# Altium project pinger-re-netlist.PrjPcb
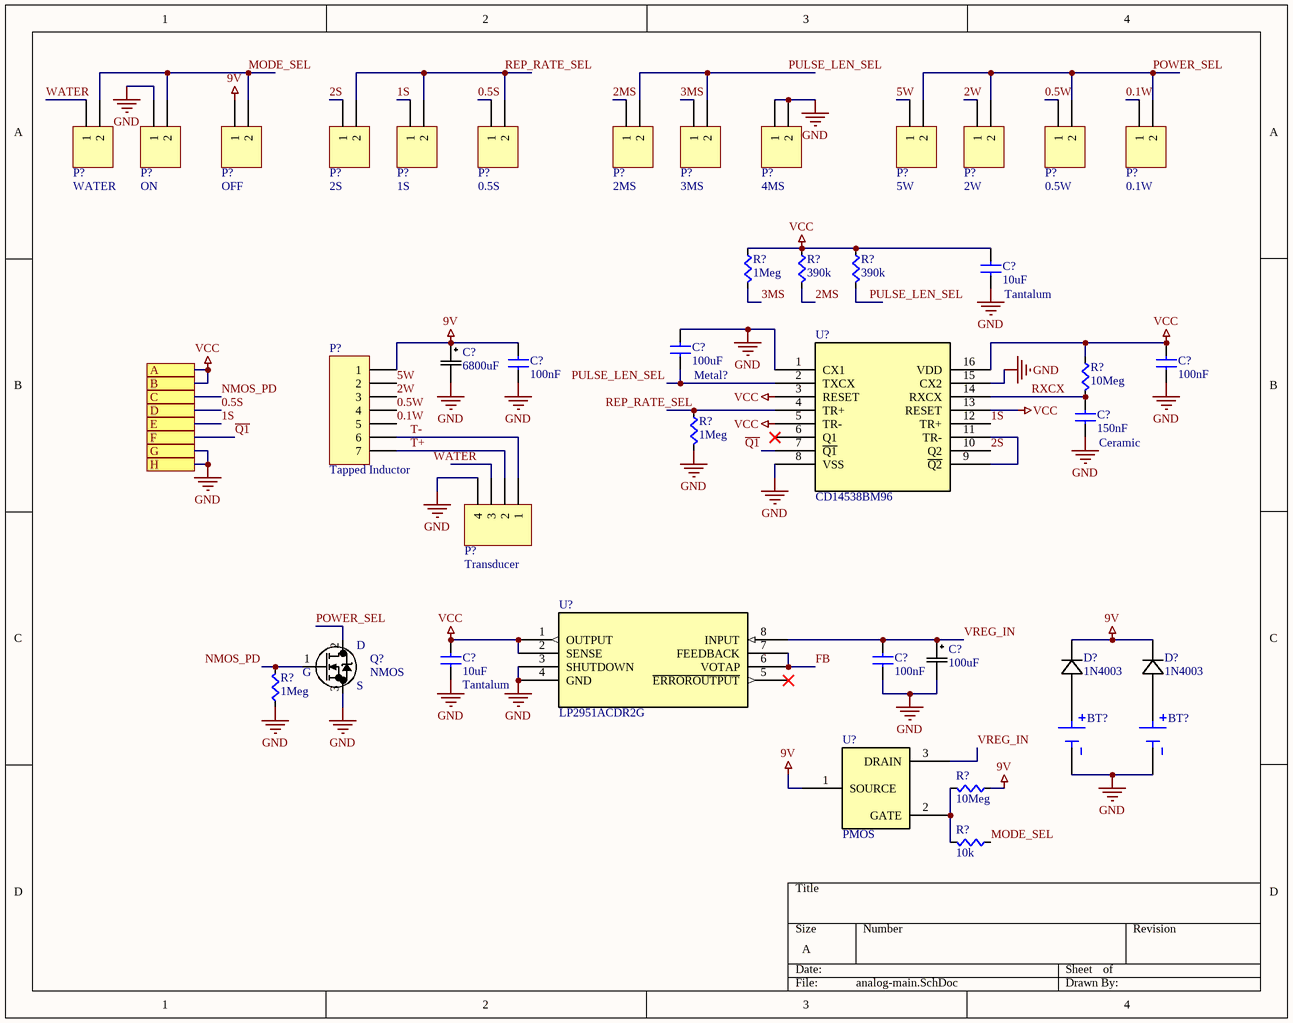
[diagram p0: analog-main.SchDoc]
2 sheets, 61 parts. Net scope: flat (ports and power ports of the same name join across sheets).
Board file: main.PcbDoc
Sheets:
  analog-main.SchDoc
  digital-main.SchDoc

## Sheet analog-main.SchDoc
size A; SheetNumber: 1; SheetTotal: 2

### Parts
(Parts that share a designator on the sheet are numbered #1, #2 ... from top to bottom, then left to right.)
BT?#1  593_594  [BAT_593]  (value not drawn)
BT?#2  593_594  [BAT_593]  (value not drawn)
C?#1  Tantalum  value 10uF  [CAPC0603]
C?#2  6800uF  [CAP_TH_RADIAL_W18MM_D7.5MM]
C?#3  Metal?  value 100uF  [CAPC0603]
C?#4  value 100nF  [CAPC0603]  (hidden comment: Cap)
C?#5  value 100nF  [CAPC0603]  (hidden comment: Cap)
C?#6  Ceramic  value 150nF  [CAPC0603]
C?#7  100uF  [CAP_SMT_RADIAL_W6.6MM_D6.3MM]
C?#8  Tantalum  value 10uF  [CAPC0603]
C?#9  value 100nF  [CAPC0603]  (hidden comment: Cap)
D?#1  1N4003  [CR_1N4005_ONS]
D?#2  1N4003  [CR_1N4005_ONS]
P?#1  WATER  [HDR1X2]
P?#2  ON  [HDR1X2]
P?#3  OFF  [HDR1X2]
P?#4  2S  [HDR1X2]
P?#5  1S  [HDR1X2]
P?#6  0.5S  [HDR1X2]
P?#7  2MS  [HDR1X2]
P?#8  3MS  [HDR1X2]
P?#9  4MS  [HDR1X2]
P?#10  5W  [HDR1X2]
P?#11  2W  [HDR1X2]
P?#12  0.5W  [HDR1X2]
P?#13  0.1W  [HDR1X2]
P?#14  Tapped Inductor  [HDR1X7]
P?#15  Transducer  [HDR1X4]
Q?  NMOS  [TO-252AA]
R?#1  value 1Meg  [RES0603]  (hidden comment: Res)
R?#2  value 390k  [RES0603]  (hidden comment: Res)
R?#3  value 390k  [RES0603]  (hidden comment: Res)
R?#4  value 10Meg  [RES0603]  (hidden comment: Res)
R?#5  value 1Meg  [RES0603]  (hidden comment: Res)
R?#6  value 1Meg  [RES0603]  (hidden comment: Res)
R?#7  value 10Meg  [RES0603]  (hidden comment: Res)
R?#8  value 10k  [RES0603]  (hidden comment: Res)
U?#1  CD14538BM96  [SOIC16-3.9MM]
U?#2  LP2951ACDR2G  [SOIC8-3.9MM]
U?#3  PMOS  [TO-92]

### Ports
A, B, C, D, E, F, G, H

### Nets
9V: C?#2.1 C?#4.1(A) D?#1.1 D?#2.1 P?#3.1 P?#14.1 R?#7.2(B) U?#3.1(SOURCE)
GND: BT?#1.2(NEG) BT?#2.2(NEG) C?#1.2(B) C?#2.2 C?#3.1(A) C?#4.2(B) C?#5.2(B) C?#6.2(B) C?#7.2 C?#8.1(A) C?#9.2(B) P?#2.1 P?#9.1 P?#9.2 P?#15.4 Q?.3(S) R?#5.1(A) R?#6.2(B) U?#1.1(CX1) U?#1.8(VSS) U?#1.15(CX2) U?#2.3(SHUTDOWN) U?#2.4(GND) ; port G, port H
VCC: C?#1.1(A) C?#5.1(A) C?#8.2(B) R?#1.2(B) R?#2.2(B) R?#3.2(B) R?#4.2(B) U?#1.3(RESET) U?#1.5(TR-) U?#1.13(RESET) U?#1.16(VDD) U?#2.1(OUTPUT) U?#2.2(SENSE) ; port A, port B
0.1W: P?#13.1 P?#14.5
0.5S: P?#6.1 ; port D
0.5W: P?#12.1 P?#14.4
1S: P?#5.1 U?#1.12(TR+) ; port E
2MS: P?#7.1 R?#2.1(A)
2S: P?#4.1 U?#1.10(Q2)
2W: P?#11.1 P?#14.3
3MS: P?#8.1 R?#1.1(A)
5W: P?#10.1 P?#14.2
FB: U?#2.6(VOTAP) U?#2.7(FEEDBACK)
MODE_SEL: P?#1.2 P?#2.2 P?#3.2 R?#8.2(B)
NMOS_PD: Q?.1(G) R?#6.1(A) ; port C  [project net joeh]
POWER_SEL: P?#10.2 P?#11.2 P?#12.2 P?#13.2 Q?.2(D)
PULSE_LEN_SEL: C?#3.2(B) P?#7.2 P?#8.2 R?#3.1(A) U?#1.2(TXCX)
~{Q1}: U?#1.7(~{Q1}) ; port F
REP_RATE_SEL: P?#4.2 P?#5.2 P?#6.2 R?#5.2(B) U?#1.4(TR+)
RXCX: C?#6.1(A) R?#4.1(A) U?#1.14(RXCX)
T+: P?#14.7 P?#15.2
T-: P?#14.6 P?#15.1
VREG_IN: C?#7.1 C?#9.1(A) U?#2.8(INPUT) U?#3.3(DRAIN)
WATER: P?#1.1 P?#15.3
NetBT?#1_1: BT?#1.1(NEG) D?#1.2
NetBT?#2_1: BT?#2.1(NEG) D?#2.2
NetR?#7_1: R?#7.1(A) R?#8.1(A) U?#3.2(GATE)
NetU?#1_9: U?#1.9(~{Q2}) U?#1.11(TR-)

Not connected (* = marked no-connect by the designer): U?#1 6(Q1)*; U?#2 5(~{ERROROUTPUT})*

### Library data of the parts
BT?#1 BT?#2 = 593_594: Battery Contact Snap (Negative) 9V Cell PC Pin; MF: Keystone Electronics; MP: 593; Package: None; Price: None; Value: *; Availability: Unavailable
C?#1 C?#3 C?#6 C?#8 = Cap: Supplier 1: Digi-Key; Supplier Part Number 1: 1276-1000-1-ND
C?#2 = UKL1A682KHD: 6800 µF 10 V Aluminum Electrolytic Capacitors Radial, Can 2000 Hrs @ 85°C; Manufacturer_Name: Nichicon; Copyright: Copyright (C) 2026 Ultra Librarian. All rights reserved.; Manufacturer_Part_Number: UKL1A682KHD; Digi-Key_Part_Number_1: UKL1A682KHD-ND
C?#7 = EXV107M025A9HAA: 100 µF 25 V Aluminum Electrolytic Capacitors Radial, Can - SMD 340mOhm @ 100kHz 3000 Hrs @ 105°C; Manufacturer_Name: Kemet; Copyright: Copyright (C) 2026 Ultra Librarian. All rights reserved.; Manufacturer_Part_Number: EXV107M025A9HAA
D?#1 D?#2 = 1N4003: Diode 200 V 1A Through Hole DO-41; Manufacturer_Name: onsemi; Copyright: Copyright (C) 2025 Ultra Librarian. All rights reserved.; Manufacturer_Part_Number: 1N4003
P?#1-P?#13 = Header 2: Header, 2-Pin; LatestRevisionDate: 17-Jul-2002; LatestRevisionNote: Re-released for DXP Platform.; Publisher: Altium Limited
P?#14 = Header 7: Header, 7-Pin; LatestRevisionDate: 17-Jul-2002; LatestRevisionNote: Re-released for DXP Platform.; Publisher: Altium Limited
P?#15 = Header 4: Header, 4-Pin; LatestRevisionDate: 17-Jul-2002; LatestRevisionNote: Re-released for DXP Platform.; Publisher: Altium Limited
Q? = RFD14N05LSM: N-Channel 50 V 14A (Tc) 48W (Tc) Surface Mount TO-252AA; Manufacturer_Name: onsemi; Copyright: Copyright (C) 2025 Ultra Librarian. All rights reserved.; Manufacturer_Part_Number: RFD14N05LSM
R?#1-R?#8 = Res: SMD, RES0603; Supplier 1: Digi-Key; Supplier Part Number 1: RMCF0603JT10K0CT-ND
U?#1 = CD14538BM96: CMOS Dual Precision Monostable Multivibrator (125 C Operation) 16-SOIC -55 to 125; Manufacturer_Name: Texas Instruments; Copyright: Copyright (C) 2025 Ultra Librarian. All rights reserved.; Manufacturer_Part_Number: CD14538BM96; RefDes: RefDes; Type: Type
U?#2 = LP2951ACDR2G: Linear Voltage Regulator IC Positive Adjustable (Fixed) 1 Output 100mA 8-SOIC; Manufacturer_Name: onsemi; Copyright: Copyright (C) 2026 Ultra Librarian. All rights reserved.; Manufacturer_Part_Number: LP2951ACDR2G; RefDes: RefDes; Type: Type
U?#3 = VP0808L-G: P-Channel 80 V 280mA (Tj) 1W (Tc) Through Hole TO-92-3; Manufacturer_Name: Microchip; Copyright: Copyright (C) 2026 Ultra Librarian. All rights reserved.; Manufacturer_Part_Number: VP0808L-G; RefDes: RefDes; Type: Type
C?#4 C?#5 C?#9 = Cap: Supplier 1: Digi-Key; Supplier Part Number 1: 1276-1000-1-ND

## Sheet digital-main.SchDoc
size A; SheetNumber: 2; SheetTotal: 2
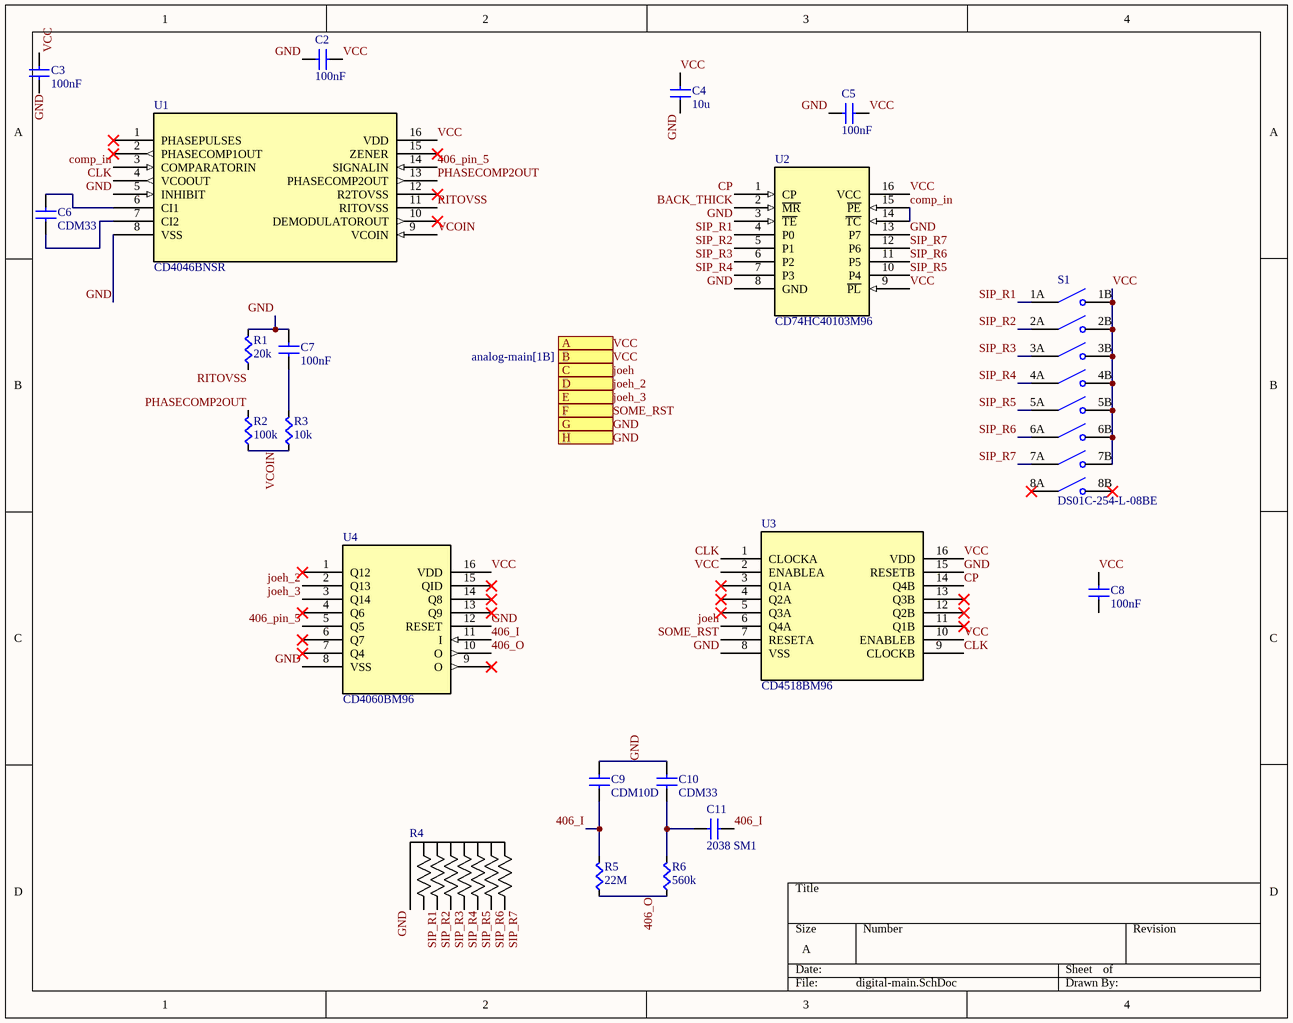
[diagram p1: digital-main.SchDoc]

### Parts
C2  value 100nF  [CAPC0603]  (hidden comment: Cap)
C3  value 100nF  [CAPC0603]  (hidden comment: Cap)
C4  value 10u  [CAPC0603]  (hidden comment: Cap)
C5  value 100nF  [CAPC0603]  (hidden comment: Cap)
C6  value CDM33  [CAPC0603]  (hidden comment: Cap)
C7  value 100nF  [CAPC0603]  (hidden comment: Cap)
C8  value 100nF  [CAPC0603]  (hidden comment: Cap)
C9  value CDM10D  [CAPC0603]  (hidden comment: Cap)
C10  value CDM33  [CAPC0603]  (hidden comment: Cap)
C11  value 2038 SM1  [CAPC0603]  (hidden comment: Cap)
R1  value 20k  [RES0603]  (hidden comment: Res)
R2  value 100k  [RES0603]  (hidden comment: Res)
R3  value 10k  [RES0603]  (hidden comment: Res)
R4  4608X-101-105LF  [BO_4608X]  (value not drawn)
R5  value 22M  [RES0603]  (hidden comment: Res)
R6  value 560k  [RES0603]  (hidden comment: Res)
S1  DS01C-254-L-08BE  [SW_DS01C-254-L-08BE]
U1  CD4046BNSR  [SOIC16-5.3MM]
U2  CD74HC40103M96  [SOIC16-3.9MM]
U3  CD4518BM96  [SOIC16-3.9MM]
U4  CD4060BM96  [SOIC16-3.9MM]

### Ports
A, B (see analog-main[1B]), C, D, E, F, G, H

### Nets
GND: C2.1(A) C3.1(A) C4.2(B) C5.1(A) C7.1(A) C9.1(A) C10.1(A) R1.1(A) R4.1 U1.5(INHIBIT) U1.8(VSS) U2.3(~{TE}) U2.8(GND) U2.13(P7) U3.8(VSS) U3.15(RESETB) U4.8(VSS) U4.12(RESET) ; port G, port H
VCC: C2.2(B) C3.2(B) C4.1(A) C5.2(B) C8.1(A) S1.1B(NO1) S1.2B(NO2) S1.3B(NO3) S1.4B(NO4) S1.5B(NO5) S1.6B(NO6) S1.7B(NO7) U1.16(VDD) U2.9(~{PL}) U2.16(VCC) U3.2(ENABLEA) U3.10(ENABLEB) U3.16(VDD) U4.16(VDD) ; port A, port B
406_I: C9.2(B) C11.2(B) R5.1(A) U4.11(I)
406_O: R5.2(B) R6.2(B) U4.10(O)
406_pin_5: U1.14(SIGNALIN) U4.5(Q5)
BACK_THICK: U2.2(~{MR})
CLK: U1.4(VCOOUT) U3.1(CLOCKA) U3.9(CLOCKB)
comp_in: U1.3(COMPARATORIN) U2.14(~{TC}) U2.15(~{PE})
CP: U2.1(CP) U3.14(Q4B)
joeh: U3.6(Q4A) ; port C
joeh_2: U4.2(Q13) ; port D  [project net 0.5S]
joeh_3: U4.3(Q14) ; port E  [project net 1S]
PHASECOMP2OUT: R2.1(A) U1.13(PHASECOMP2OUT)
RITOVSS: R1.2(B) U1.11(RITOVSS)
SIP_R1: R4.2 S1.1A(COM1) U2.4(P0)
SIP_R2: R4.3 S1.2A(COM2) U2.5(P1)
SIP_R3: R4.4 S1.3A(COM3) U2.6(P2)
SIP_R4: R4.5 S1.4A(COM4) U2.7(P3)
SIP_R5: R4.6 S1.5A(COM5) U2.10(P4)
SIP_R6: R4.7 S1.6A(COM6) U2.11(P5)
SIP_R7: R4.8 S1.7A(COM7) U2.12(P6)
SOME_RST: U3.7(RESETA) ; port F  [project net ~{Q1}]
VCOIN: R2.2(B) R3.2(B) U1.9(VCOIN)
NetC6_1: C6.1(A) U1.6(CI1)
NetC6_2: C6.2(B) U1.7(CI2)
NetC7_2: C7.2(B) R3.1(A)
NetC10_2: C10.2(B) C11.1(A) R6.1(A)

Not connected (* = marked no-connect by the designer): C8 2(B); S1 8A(COM8)* 8B(NO8)*; U1 1(PHASEPULSES)* 2(PHASECOMP1OUT)* 10(DEMODULATOROUT)* 12(R2TOVSS)* 15(ZENER)*; U3 3(Q1A)* 4(Q2A)* 5(Q3A)* 11(Q1B)* 12(Q2B)* 13(Q3B)*; U4 1(Q12)* 4(Q6)* 6(Q7)* 7(Q4)* 9(O)* 13(Q9)* 14(Q8)* 15(QID)*

### Library data of the parts
R1-R3 R5 R6 = Res: SMD, RES0603; Supplier 1: Digi-Key; Supplier Part Number 1: RMCF0603JT10K0CT-ND
R4 = 4608X-101-105LF: 1M Ohm ±2% 200mW Power Per Element Bussed 7 Resistor Network/Array ±100ppm/°C 8-SIP; Manufacturer_Name: Bourns Electronics; Copyright: Copyright (C) 2026 Ultra Librarian. All rights reserved.; Manufacturer_Part_Number: 4608X-101-105LF
S1 = DS01C-254-L-08BE: 8 Position, Through Hole, 2.54 mm Pitch, Raised Slide Actuator, Convex Bottom, Long Pin, DIP Switch; MF: Same Sky; SnapEDA_Link: https://www.snapeda.com/parts/DS01C-254-L-08BE/Same+Sky/view-part/?ref=snap; Package: None; Value: *; MP: DS01C-254-L-08BE; Check_prices: https://www.snapeda.com/parts/DS01C-254-L-08BE/Same+Sky/view-part/?ref=eda
U1 = CD4046BNSR: CMOS Micropower Phase-Locked Loop 16-SOP -55 to 125; Manufacturer_Name: Texas Instruments; Copyright: Copyright (C) 2025 Ultra Librarian. All rights reserved.; Manufacturer_Part_Number: CD4046BNSR; RefDes: RefDes; Type: Type
U2 = CD74HC40103M96: High Speed CMOS Logic 8-Stage Synchronous Down Counters 16-SOIC -55 to 125; Manufacturer_Name: Texas Instruments; Copyright: Copyright (C) 2025 Ultra Librarian. All rights reserved.; Manufacturer_Part_Number: CD74HC40103M96; RefDes: RefDes; Type: Type
U3 = CD4518BM96: CMOS Dual BCD Up-Counter 16-SOIC -55 to 125; Manufacturer_Name: Texas Instruments; Copyright: Copyright (C) 2026 Ultra Librarian. All rights reserved.; Manufacturer_Part_Number: CD4518BM96; RefDes: RefDes; Type: Type
U4 = CD4060BM96: CMOS 14-Stage Ripple-Carry Binary Counter/Divider and Oscillator 16-SOIC -55 to 125; Manufacturer_Name: Texas Instruments; Copyright: Copyright (C) 2025 Ultra Librarian. All rights reserved.; Manufacturer_Part_Number: CD4060BM96; RefDes: RefDes; Type: Type
C2-C11 = Cap: Supplier 1: Digi-Key; Supplier Part Number 1: 1276-1000-1-ND

## Nets that join several sheets
GND: analog-main (23 pins), digital-main (18 pins)
VCC: analog-main (13 pins), digital-main (19 pins)
0.5S: analog-main (P?#6.1), digital-main (U4.2)
1S: analog-main (P?#5.1 U?#1.12), digital-main (U4.3)
joeh: analog-main (Q?.1 R?#6.1), digital-main (U3.6)
~{Q1}: analog-main (U?#1.7), digital-main (U3.7)